# Altium project F4Test.PrjPcb
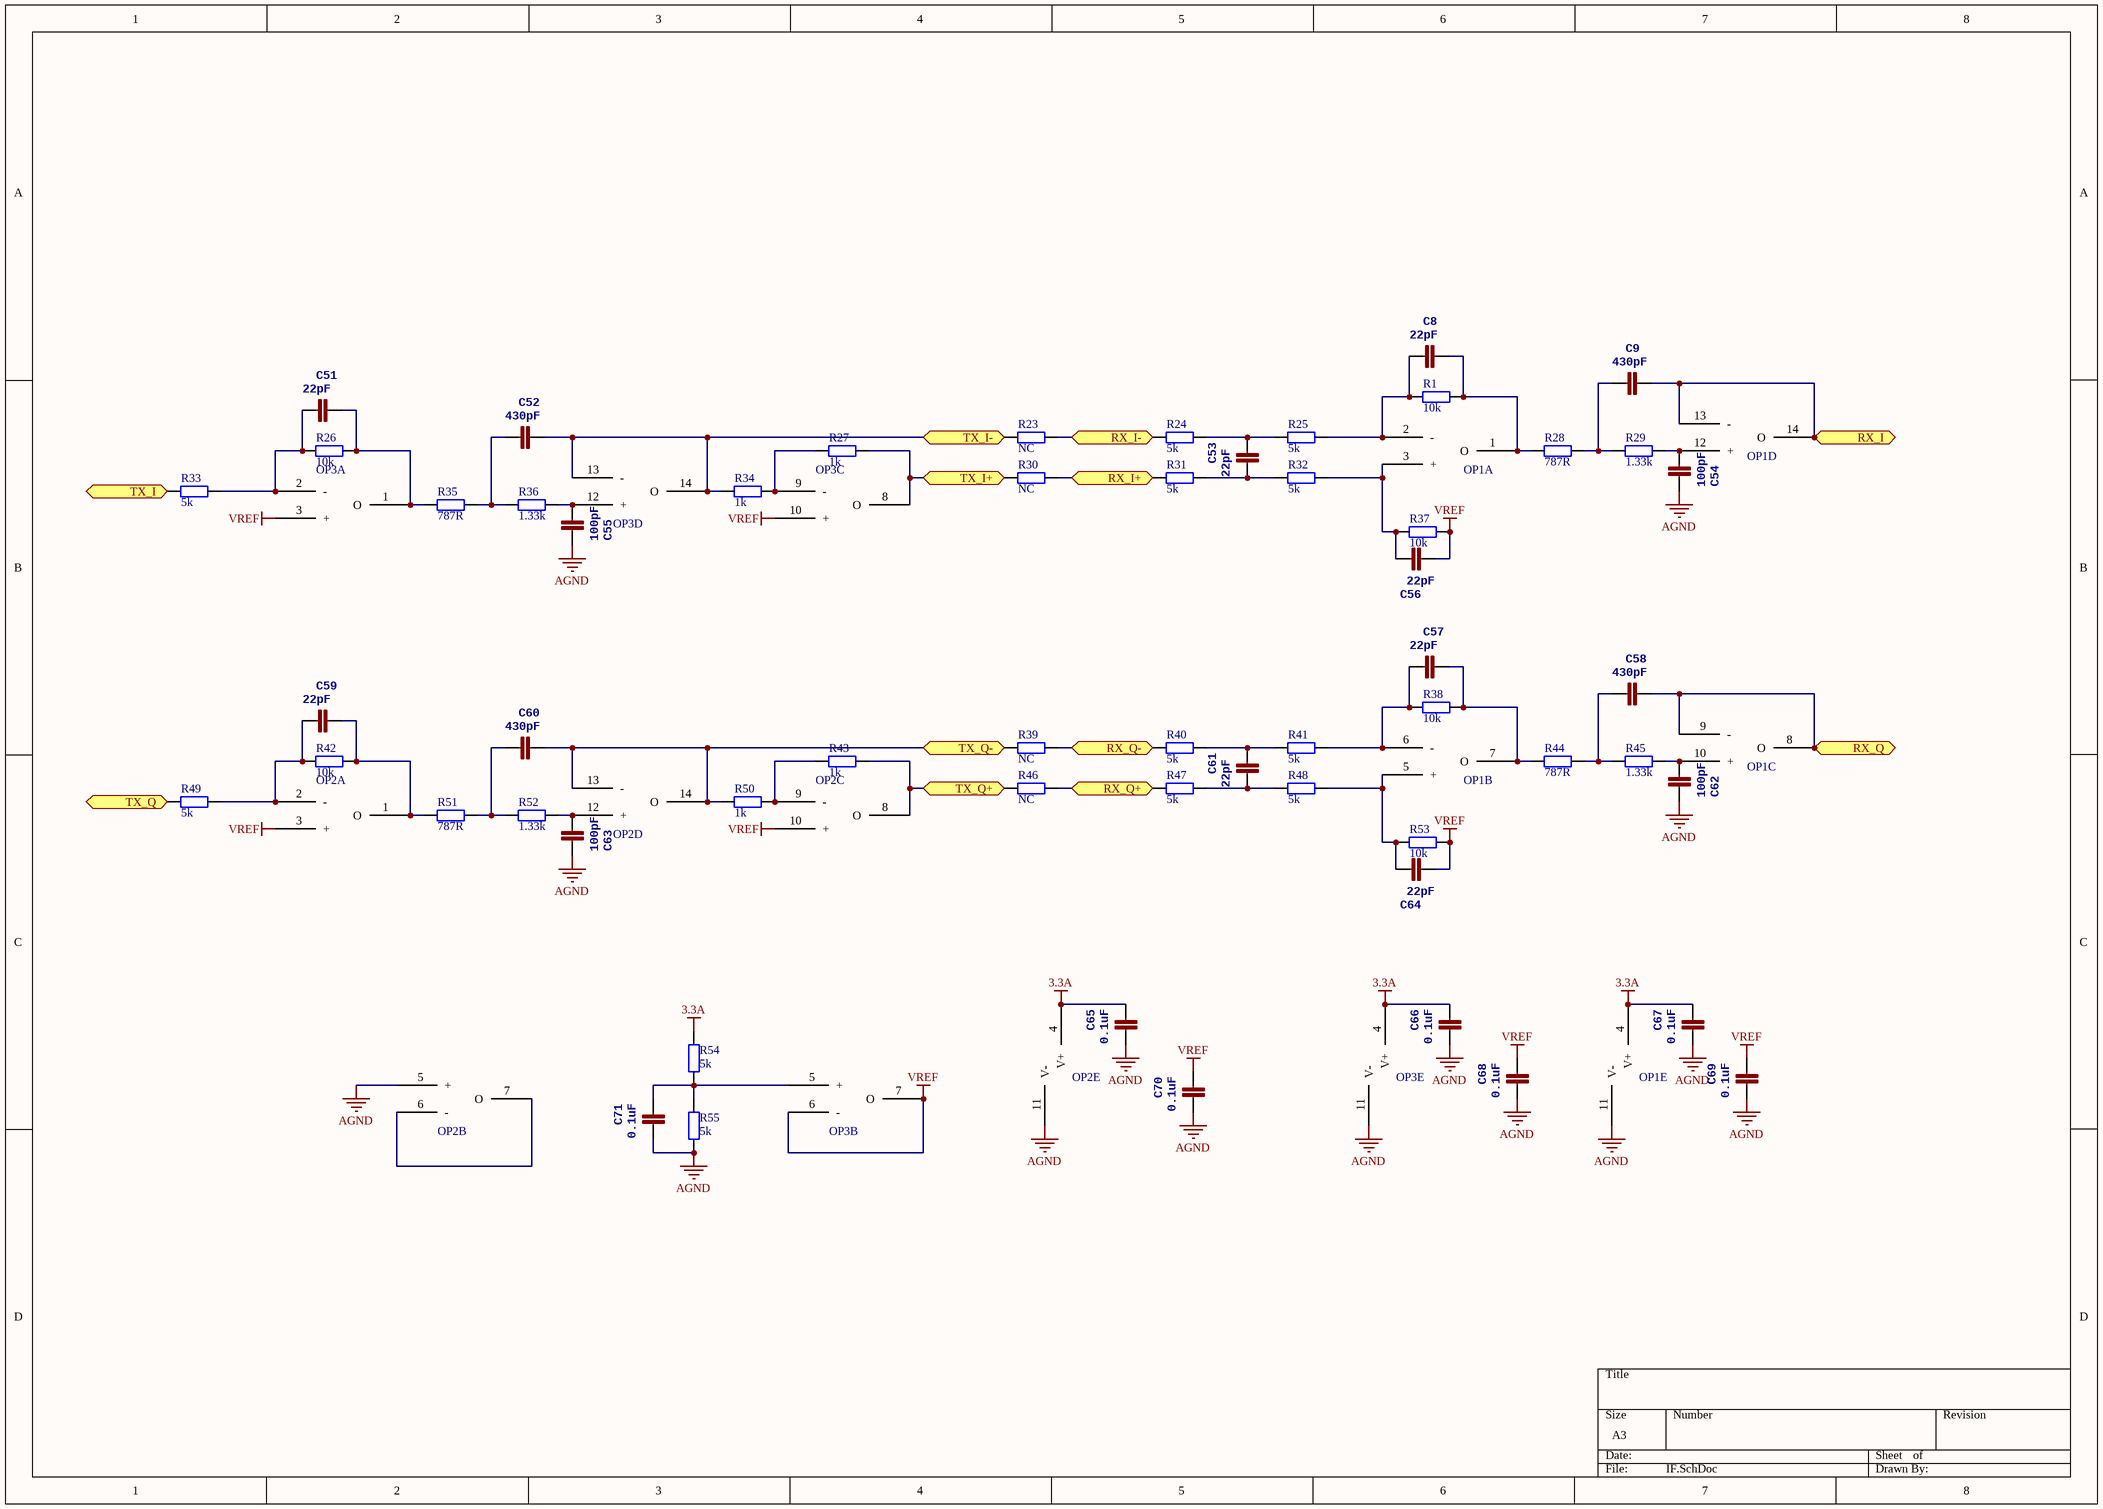
[diagram p0: IF.SchDoc]
3 sheets, 127 parts. Net scope: flat (ports and power ports of the same name join across sheets).
Board file: F4Test.PcbDoc
Sheets:
  IF.SchDoc
  USB_HS2.SchDoc
  mcu2.SchDoc

## Sheet IF.SchDoc
size A3

### Parts
C8  22pF  [0402]
C9  430pF  [0402]
C51  22pF  [0402]
C52  430pF  [0402]
C53  22pF  [0402]
C54  100pF  [0402]
C55  100pF  [0402]
C56  22pF  [0402]
C57  22pF  [0402]
C58  430pF  [0402]
C59  22pF  [0402]
C60  430pF  [0402]
C61  22pF  [0402]
C62  100pF  [0402]
C63  100pF  [0402]
C64  22pF  [0402]
C65  0.1uF  [0402]
C66  0.1uF  [0402]
C67  0.1uF  [0402]
C68  0.1uF  [0402]
C69  0.1uF  [0402]
C70  0.1uF  [0402]
C71  0.1uF  [0402]
OP1  MCP6024  (value not drawn)  (parts A,B,C,D,E of 5)
OP2  MCP6024  (value not drawn)  (parts A,B,C,D,E of 5)
OP3  MCP6024  (value not drawn)  (parts A,B,C,D,E of 5)
R1  10k  [0402]
R23  NC  [0402]
R24  5k  [0402]
R25  5k  [0402]
R26  10k  [0402]
R27  1k  [0402]
R28  787R  [0402]
R29  1.33k  [0402]
R30  NC  [0402]
R31  5k  [0402]
R32  5k  [0402]
R33  5k  [0402]
R34  1k  [0402]
R35  787R  [0402]
R36  1.33k  [0402]
R37  10k  [0402]
R38  10k  [0402]
R39  NC  [0402]
R40  5k  [0402]
R41  5k  [0402]
R42  10k  [0402]
R43  1k  [0402]
R44  787R  [0402]
R45  1.33k  [0402]
R46  NC  [0402]
R47  5k  [0402]
R48  5k  [0402]
R49  5k  [0402]
R50  1k  [0402]
R51  787R  [0402]
R52  1.33k  [0402]
R53  10k  [0402]
R54  5k  [0402]
R55  5k  [0402]

### Ports
RX_I, RX_I+, RX_I-, RX_Q, RX_Q+, RX_Q-, TX_I, TX_I+, TX_I-, TX_Q, TX_Q+, TX_Q-

### Nets
3.3A: C65.1 C66.1 C67.1 OP1.4(V+) OP2.4(V+) OP3.4(V+) R54.1
AGND: C54.1 C55.1 C62.1 C63.1 C65.2 C66.2 C67.2 C68.2 C69.2 C70.2 C71.2 OP1.11(V-) OP2.5(+) OP2.11(V-) OP3.11(V-) R55.2
VREF: C56.2 C64.2 C68.1 C69.1 C70.1 OP2.3(+) OP2.10(+) OP3.3(+) OP3.6(-) OP3.7(O) OP3.10(+) R37.1 R53.1
NetC8_1: C8.1 OP1.1(O) R1.1 R28.2
NetC8_2: C8.2 OP1.2(-) R1.2 R25.1
NetC9_1: C9.1 OP1.13(-) OP1.14(O) ; port RX_I
NetC9_2: C9.2 R28.1 R29.2
NetC51_1: C51.1 OP3.1(O) R26.1 R35.2
NetC51_2: C51.2 OP3.2(-) R26.2 R33.1
NetC52_1: C52.1 OP3.13(-) OP3.14(O) R23.2 R34.2 ; port TX_I-
NetC52_2: C52.2 R35.1 R36.2
NetC53_1: C53.1 R24.1 R25.2
NetC53_2: C53.2 R31.1 R32.2
NetC54_2: C54.2 OP1.12(+) R29.1
NetC55_2: C55.2 OP3.12(+) R36.1
NetC56_1: C56.1 OP1.3(+) R32.1 R37.2
NetC57_1: C57.1 OP1.7(O) R38.1 R44.2
NetC57_2: C57.2 OP1.6(-) R38.2 R41.1
NetC58_1: C58.1 OP1.8(O) OP1.9(-) ; port RX_Q
NetC58_2: C58.2 R44.1 R45.2
NetC59_1: C59.1 OP2.1(O) R42.1 R51.2
NetC59_2: C59.2 OP2.2(-) R42.2 R49.1
NetC60_1: C60.1 OP2.13(-) OP2.14(O) R39.2 R50.2 ; port TX_Q-
NetC60_2: C60.2 R51.1 R52.2
NetC61_1: C61.1 R40.1 R41.2
NetC61_2: C61.2 R47.1 R48.2
NetC62_2: C62.2 OP1.10(+) R45.1
NetC63_2: C63.2 OP2.12(+) R52.1
NetC64_1: C64.1 OP1.5(+) R48.1 R53.2
NetC71_1: C71.1 OP3.5(+) R54.2 R55.1
NetOP2_6: OP2.6(-) OP2.7(O)
NetOP2_8: OP2.8(O) R43.1 R46.2 ; port TX_Q+
NetOP2_9: OP2.9(-) R43.2 R50.1
NetOP3_8: OP3.8(O) R27.1 R30.2 ; port TX_I+
NetOP3_9: OP3.9(-) R27.2 R34.1
NetR3_2: R49.2 ; port TX_Q
NetR23_1: R23.1 R24.2 ; port RX_I-
NetR30_1: R30.1 R31.2 ; port RX_I+
NetR33_2: R33.2 ; port TX_I
NetR39_1: R39.1 R40.2 ; port RX_Q-
NetR46_1: R46.1 R47.2 ; port RX_Q+

### Library data of the parts
C8 C9 C51-C71 = CAP0402-CAP: <b>Capacitor</b> / Standard 0603 ceramic capacitor, and 0.1" leaded capacitor.; PARTNO: CC0402ZRY5V7BB104
OP1-OP3 = OP-SOP14
R1 R23-R55 = Res2: Resistor; Published: 8-Jun-2000; LatestRevisionDate: 17-Jul-2002; LatestRevisionNote: Re-released for DXP Platform.; PackageReference: AXIAL-0.4; Publisher: Altium Limited; PackageDescription: Axial Device, Thru-Hole; 2 Leads; 0.4 in Pin Spacing

## Sheet USB_HS2.SchDoc
size A4
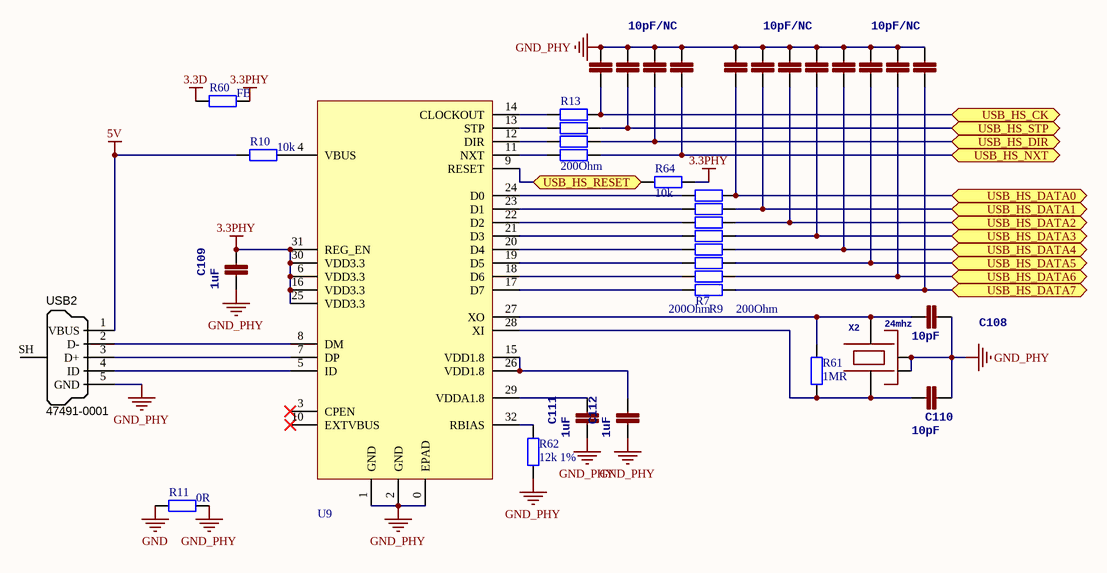
[diagram p1: USB_HS2.SchDoc]

### Parts
(Parts that share a designator on the sheet are numbered #1, #2 ... from top to bottom, then left to right.)
C17  10pF/NC  [0402]
C18  1n  [0402]  (value not drawn)
C19  1n  [0402]  (value not drawn)
C20  1n  [0402]  (value not drawn)
C21  10pF/NC  [0402]
C22  1n  [0402]  (value not drawn)
C23  1n  [0402]  (value not drawn)
C24  1n  [0402]  (value not drawn)
C25  10pF/NC  [0402]
C26  1n  [0402]  (value not drawn)
C27  1n  [0402]  (value not drawn)
C28  1n  [0402]  (value not drawn)
C108  10pF  [0402]
C109  1uF  [0402]
C110  10pF  [0402]
C111  1uF  [0402]
C112  1uF  [0402]
R7  value 200Ohm  [0402X4]  (hidden comment: Res*4)
R9  value 200Ohm  [0402X4]  (hidden comment: Res*4)
R10  10k  [0402]
R11  0R  [0603]
R13#1  value 200Ohm  [0402X4]  (hidden comment: Res*4)
R60  FB  [0603]
R61  1MR  [0402]
R62  12k 1%  [0402]
R64  10k  [0402]
U9  USB3300_1  [USB3300]  (value not drawn)
USB2  Manufacturer Part Number 1: 47491-0001  [MICRO-YZX]  (hidden comment: USB Micro Type B)
X2  24mhz  [OSCILLATOR-3.2X2.5]

### Ports
USB_HS_CK, USB_HS_DATA0, USB_HS_DATA1, USB_HS_DATA2, USB_HS_DATA3, USB_HS_DATA4, USB_HS_DATA5, USB_HS_DATA6, USB_HS_DATA7, USB_HS_DIR, USB_HS_NXT, USB_HS_RESET, USB_HS_STP

### Nets
3.3D: R60.1
3.3PHY: C109.1 R60.2 R64.1 U9.6(VDD3.3) U9.16(VDD3.3) U9.25(VDD3.3) U9.30(VDD3.3) U9.31(REG_EN)
5V: R10.1 USB2.1(VBUS)
GND: R11.1
GND_PHY: C17.2 C18.2 C19.2 C20.2 C21.2 C22.2 C23.2 C24.2 C25.2 C26.2 C27.2 C28.2 C108.1 C109.2 C110.1 C111.2 C112.2 R11.2 R62.1 U9.0(EPAD) U9.1(GND) U9.2(GND) USB2.5(GND) X2.2(NC_2) X2.4(NC_4)
NetC17_1: C17.1 R13#1.4 ; port USB_HS_CK
NetC18_1: C18.1 R13#1.3 ; port USB_HS_STP
NetC19_1: C19.1 R13#1.2 ; port USB_HS_DIR
NetC20_1: C20.1 R13#1.1 ; port USB_HS_NXT
NetC21_1: C21.1 R9.8 ; port USB_HS_DATA0
NetC22_1: C22.1 R9.7 ; port USB_HS_DATA1
NetC23_1: C23.1 R9.6 ; port USB_HS_DATA2
NetC24_1: C24.1 R9.5 ; port USB_HS_DATA3
NetC25_1: C25.1 R7.8 ; port USB_HS_DATA4
NetC26_1: C26.1 R7.7 ; port USB_HS_DATA5
NetC27_1: C27.1 R7.6 ; port USB_HS_DATA6
NetC28_1: C28.1 R7.5 ; port USB_HS_DATA7
NetC108_2: C108.2 R61.2 U9.27(XO) X2.3
NetC110_2: C110.2 R61.1 U9.28(XI) X2.1
NetC111_1: C111.1 U9.29(VDDA1.8)
NetC112_1: C112.1 U9.15(VDD1.8) U9.26(VDD1.8)
NetR7_1: R7.1 U9.20(D4)
NetR7_2: R7.2 U9.19(D5)
NetR7_3: R7.3 U9.18(D6)
NetR7_4: R7.4 U9.17(D7)
NetR9_1: R9.1 U9.24(D0)
NetR9_2: R9.2 U9.23(D1)
NetR9_3: R9.3 U9.22(D2)
NetR9_4: R9.4 U9.21(D3)
NetR10_2: R10.2 U9.4(VBUS)
NetR13#1_5: R13#1.5 U9.14(CLOCKOUT)
NetR13#1_6: R13#1.6 U9.13(STP)
NetR13#1_7: R13#1.7 U9.12(DIR)
NetR13#1_8: R13#1.8 U9.11(NXT)
NetR62_2: R62.2 U9.32(RBIAS)
NetR64_2: R64.2 U9.9(RESET) ; port USB_HS_RESET
NetU9_5: U9.5(ID) USB2.4(ID)
NetU9_7: U9.7(DP) USB2.3(D+)
NetU9_8: U9.8(DM) USB2.2(D-)

Not connected (* = marked no-connect by the designer): U9 3(CPEN)* 10(EXTVBUS)*; USB2 SH(Shell)

### Library data of the parts
C17-C28 C108-C112 = CAP0402-CAP: as C8 on sheet IF
R7 R9 R13#1 = Res*4: Resistor; Published: 8-Jun-2000; LatestRevisionDate: 17-Jul-2002; LatestRevisionNote: Re-released for DXP Platform.; PackageReference: AXIAL-0.4; Publisher: Altium Limited; PackageDescription: Axial Device, Thru-Hole; 2 Leads; 0.4 in Pin Spacing
R10 R11 R60-R62 R64 = Res2: Resistor; Value: 0Ohm; Published: 8-Jun-2000; LatestRevisionDate: 17-Jul-2002; LatestRevisionNote: Re-released for DXP Platform.; PackageReference: AXIAL-0.4; Publisher: Altium Limited; PackageDescription: Axial Device, Thru-Hole; 2 Leads; 0.4 in Pin Spacing
USB2 = USB_Micro_TypeB: Connector SMD USB Micro Type B middle mount; Manufacturer 1: Molex Inc; SCDType: undef; Package / Case: SMD; Supplier 1: Digi-Key; Supplier Part Number 1: WM17142CT-ND
X2 = OSCILLATOR-3.2X2.5: Crystal Oscillator in 3.2x2.5 SMD

## Sheet mcu2.SchDoc
size A4
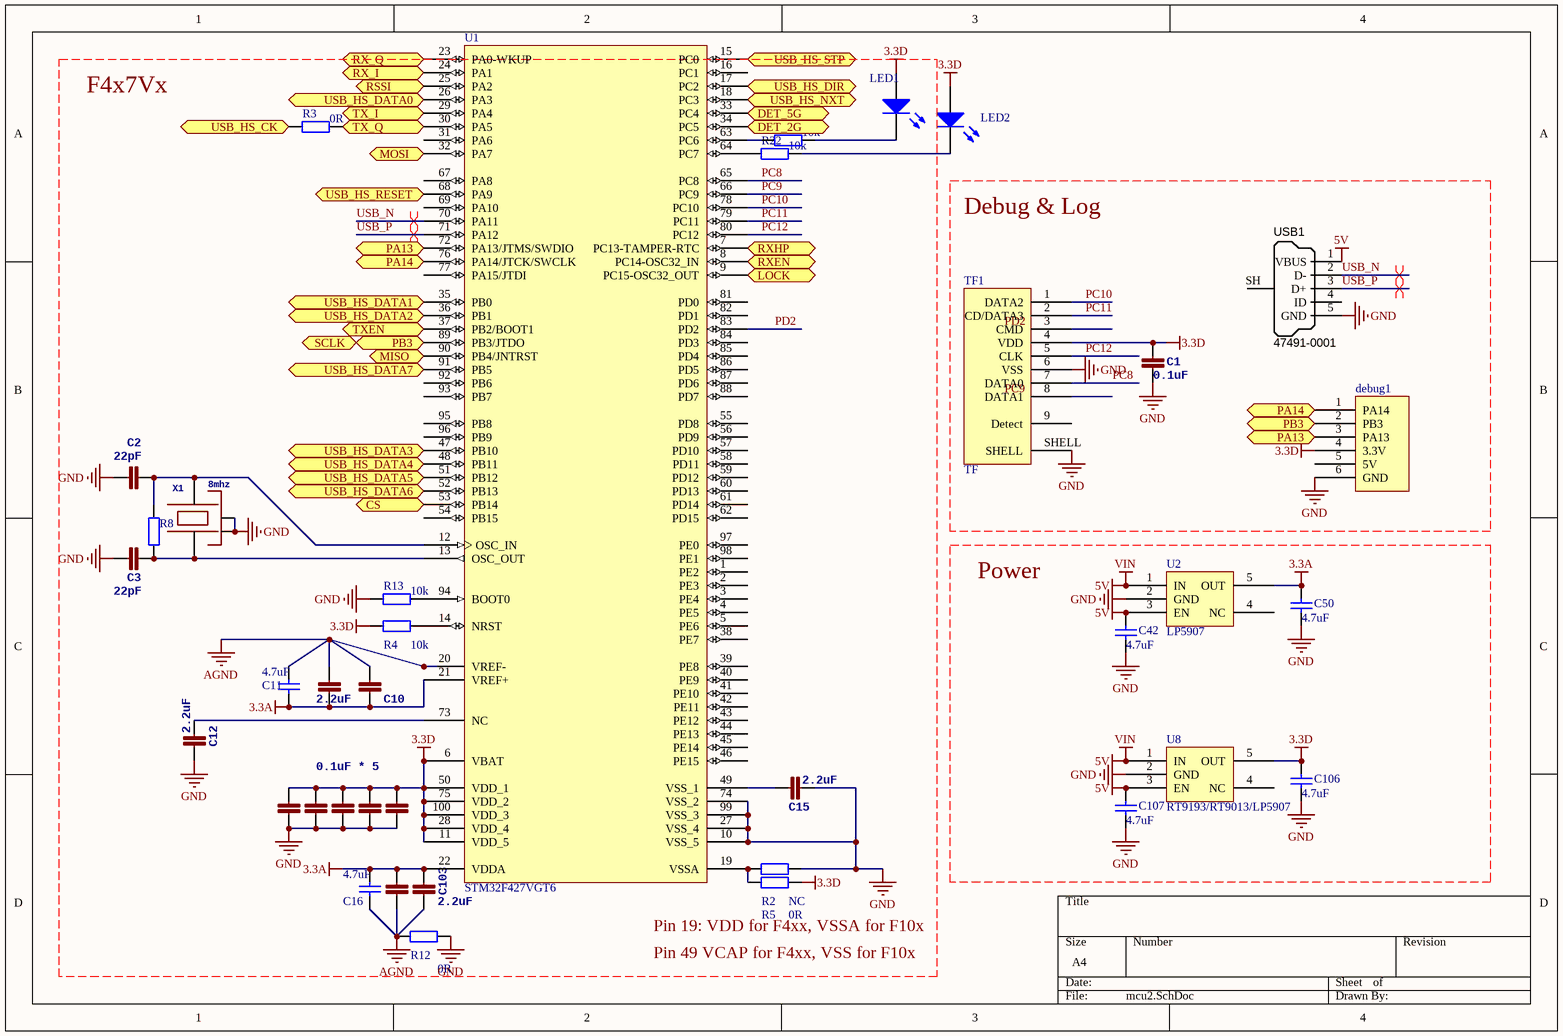
[diagram p2: mcu2.SchDoc]

### Parts
(Parts that share a designator on the sheet are numbered #1, #2 ... from top to bottom, then left to right.)
C1  0.1uF  [0402]
C2  22pF  [0402]
C3  22pF  [0402]
C4  0.1uF * 5  [0402]
C5  1n  [0402]  (value not drawn)
C6  1n  [0402]  (value not drawn)
C7  1n  [0402]  (value not drawn)
C10  2.2uF  [0603]
C11  4.7uF  [0805]
C12  2.2uF  [0603]
C13  1n  [0402]  (value not drawn)
C14  1n  [0402]  (value not drawn)
C15  2.2uF  [0603]
C16  4.7uF  [0805]
C42  4.7uF  [0603]
C50  4.7uF  [0603]
C102  1n  [0402]  (value not drawn)
C103  2.2uF  [0603]
C106  4.7uF  [0603]
C107  4.7uF  [0603]
debug1  debug  [WFRSM125]  (value not drawn)
LED1  LED0  [0603]  (value not drawn)
LED2  LED0  [0603]  (value not drawn)
R2  0R  [0402]
R3  0R  [0402]
R4  10k  [0402]
R5  NC  [0402]
R8  (no value)  [0402]
R12  0R  [0402]
R13#2  10k  [0402]
R21  10k  [0402]
R22  10k  [0402]
TF1  TF  [TF]
U1  STM32F427VGT6  [LQFP100_N]
U2  LP5907  [SOT23-5]
U8  RT9193/RT9013/LP5907  [SOT23-5]
USB1  Manufacturer Part Number 1: 47491-0001  [MICRO-YZX]  (hidden comment: USB Micro Type B)
X1  8mhz  [OSCILLATOR-3.2X2.5]

### Ports
CS, DET_2G, DET_5G, LOCK, MISO, MOSI, PA13, PA14, PB3, RSSI, RX_I, RX_Q, RXEN, RXHP, SCLK, TX_I, TX_Q, TXEN, USB_HS_CK, USB_HS_DATA0, USB_HS_DATA1, USB_HS_DATA2, USB_HS_DATA3, USB_HS_DATA4, USB_HS_DATA5, USB_HS_DATA6, USB_HS_DATA7, USB_HS_DIR, USB_HS_NXT, USB_HS_RESET, USB_HS_STP

### Nets
3.3A: C7.1 C10.1 C11.2 C16.1 C50.2 C102.2 C103.2 U1.21(VREF+) U1.22(VDDA) U2.5(OUT)
3.3D: C1.2 C4.2 C5.2 C6.2 C13.2 C14.2 C106.2 debug1.4(3.3V) LED1.1(A) LED2.1(A) R2.1 R4.2 TF1.4(VDD) U1.6(VBAT) U1.11(VDD_5) U1.28(VDD_4) U1.50(VDD_1) U1.75(VDD_2) U1.100(VDD_3) U8.5(OUT)
5V: C42.2 C107.2 U2.1(IN) U2.3(EN) U8.1(IN) U8.3(EN) USB1.1(VBUS)  [also labelled VIN]
AGND: C7.2 C10.2 C11.1 C16.2 C102.1 C103.1 R12.2 U1.20(VREF-)
GND: C1.1 C2.2 C3.2 C4.1 C5.1 C6.1 C12.1 C13.1 C14.1 C15.2 C42.1 C50.1 C106.1 C107.1 debug1.6(GND) R5.1 R12.1 R13#2.1 TF1.6(VSS) TF1.SHELL U1.10(VSS_5) U1.27(VSS_4) U1.74(VSS_2) U1.99(VSS_3) U2.2(GND) U8.2(GND) USB1.5(GND) X1.2(NC_2) X1.4(NC_4)
PC8: TF1.7(DATA0) U1.65(PC8)
PC9: U1.66(PC9)
PC10: TF1.1(DATA2) U1.78(PC10)
PC11: TF1.2(CD/DATA3) U1.79(PC11)
PC12: TF1.5(CLK) U1.80(PC12)
PD2: U1.83(PD2)
USB_N: U1.70(PA11) USB1.2(D-)
USB_P: U1.71(PA12) USB1.3(D+)
NetC2_1: C2.1 R8.2 U1.12(OSC_IN) X1.3
NetC3_1: C3.1 R8.1 U1.13(OSC_OUT) X1.1
NetC9_1: U1.24(PA1) ; port RX_I
NetC12_2: C12.2 U1.73(NC)
NetC15_1: C15.1 U1.49(VSS_1)
NetC17_1: R3.1 ; port USB_HS_CK
NetC18_1: U1.15(PC0) ; port USB_HS_STP
NetC19_1: U1.17(PC2) ; port USB_HS_DIR
NetC20_1: U1.18(PC3) ; port USB_HS_NXT
NetC21_1: U1.26(PA3) ; port USB_HS_DATA0
NetC22_1: U1.35(PB0) ; port USB_HS_DATA1
NetC23_1: U1.36(PB1) ; port USB_HS_DATA2
NetC24_1: U1.47(PB10) ; port USB_HS_DATA3
NetC25_1: U1.48(PB11) ; port USB_HS_DATA4
NetC26_1: U1.51(PB12) ; port USB_HS_DATA5
NetC27_1: U1.52(PB13) ; port USB_HS_DATA6
NetC28_1: U1.91(PB5) ; port USB_HS_DATA7
NetC58_1: U1.23(PA0-WKUP) ; port RX_Q
Netdebug1_1: debug1.1(PA14) U1.76(PA14/JTCK/SWCLK) ; port PA14
Netdebug1_2: debug1.2(PB3) U1.89(PB3/JTDO) ; port SCLK, port PB3
Netdebug1_3: debug1.3(PA13) U1.72(PA13/JTMS/SWDIO) ; port PA13
NetLED1_2: LED1.2(K) R21.2
NetLED2_2: LED2.2(K) R22.2
NetR2_2: R2.2 R5.2 U1.19(VSSA)
NetR3_2: R3.2 U1.30(PA5) ; port TX_Q
NetR4_1: R4.1 U1.14(NRST)
NetR13#2_2: R13#2.2 U1.94(BOOT0)
NetR21_1: R21.1 U1.63(PC6)
NetR22_1: R22.1 U1.64(PC7)
NetR33_2: U1.29(PA4) ; port TX_I
NetR64_2: U1.68(PA9) ; port USB_HS_RESET
NetU1_7: U1.7(PC13-TAMPER-RTC) ; port RXHP
NetU1_8: U1.8(PC14-OSC32_IN) ; port RXEN
NetU1_9: U1.9(PC15-OSC32_OUT) ; port LOCK
NetU1_25: U1.25(PA2) ; port RSSI
NetU1_32: U1.32(PA7) ; port MOSI
NetU1_33: U1.33(PC4) ; port DET_5G
NetU1_34: U1.34(PC5) ; port DET_2G
NetU1_37: U1.37(PB2/BOOT1) ; port TXEN
NetU1_53: U1.53(PB14) ; port CS
NetU1_90: U1.90(PB4/JNTRST) ; port MISO

Not connected (* = marked no-connect by the designer): debug1 5(5V); TF1 3(CMD) 8(DATA1) 9(Detect); U1 1(PE2) 2(PE3) 3(PE4) 4(PE5) 5(PE6) 16(PC1) 31(PA6) 38(PE7) 39(PE8) 40(PE9) 41(PE10) 42(PE11) 43(PE12) 44(PE13) 45(PE14) 46(PE15) 54(PB15) 55(PD8) 56(PD9) 57(PD10) 58(PD11) 59(PD12) 60(PD13) 61(PD14) 62(PD15) 67(PA8) 69(PA10) 77(PA15/JTDI) 81(PD0) 82(PD1) 84(PD3) 85(PD4) 86(PD5) 87(PD6) 88(PD7) 92(PB6) 93(PB7) 95(PB8) 96(PB9) 97(PE0) 98(PE1); U2 4(NC); U8 4(NC); USB1 4(ID) SH(Shell)

### Layout directives
differential pair: USB_N, USB_P

### Notes on the sheet
- F4x7Vx
- Debug & Log
- Power
- Pin 19: VDD for F4xx, VSSA for F10x
- Pin 49 VCAP for F4xx, VSS for F10x
- Labels drawn without touching a wire or pin: PC9, PD2

### Library data of the parts
C1-C7 C10 C12-C15 C102 C103 = CAP0402-CAP: as C8 on sheet IF
C11 C16 C42 C50 C106 C107 = Cap: Capacitor; Published: 8-Jun-2000; LatestRevisionDate: 17-Jul-2002; LatestRevisionNote: Re-released for DXP Platform.; PackageReference: RAD-0.3; Publisher: Altium Limited; PackageDescription: Radial Cap, Thru-Hole; 2 Leads; 0.3 in Pin Spacing
LED1 LED2 = LED0: Typical INFRARED GaAs LED; Published: 8-Jun-2000; LatestRevisionDate: 08-Jul-2005; LatestRevisionNote: Mech Layer 1 removed.; PackageReference: LED-0; Publisher: Altium Limited; PackageDescription: LED; 2 Leads
R2-R5 R8 R12 R13#2 R21 R22 = Res2: Resistor; Value: 0Ohm; Published: 8-Jun-2000; LatestRevisionDate: 17-Jul-2002; LatestRevisionNote: Re-released for DXP Platform.; PackageReference: AXIAL-0.4; Publisher: Altium Limited; PackageDescription: Axial Device, Thru-Hole; 2 Leads; 0.4 in Pin Spacing
U1 = STM32F103VBT6: STM32 ARM-based 32-bit MCU with 64 Kbytes Flash, 100-pin LQFP, Industrial Temperature; Published: *; DatasheetVersion: *; PackageVersion: *; PackageReference: *; Publisher: *; PackageDescription: *; ComponentLink1Description: *; ComponentLink1URL: *; ComponentLink2Description: *; ComponentLink2URL: *
U8 = LP5907
USB1 = USB_Micro_TypeB: as USB2 on sheet USB_HS2; Package / Case: SMD; Supplier 1: Digi-Key; Supplier Part Number 1: WM17142CT-ND
X1 = OSCILLATOR-3.2X2.5: Crystal Oscillator in 3.2x2.5 SMD

## Nets that join several sheets
3.3A: IF (7 pins), mcu2 (10 pins)
3.3D: USB_HS2 (R60.1), mcu2 (20 pins)
5V: USB_HS2 (R10.1 USB2.1), mcu2 (7 pins)
AGND: IF (16 pins), mcu2 (8 pins)
GND: USB_HS2 (R11.1), mcu2 (29 pins)
NetC9_1: IF (C9.1 OP1.13 OP1.14), mcu2 (U1.24)
NetC17_1: USB_HS2 (C17.1 R13#1.4), mcu2 (R3.1)
NetC18_1: USB_HS2 (C18.1 R13#1.3), mcu2 (U1.15)
NetC19_1: USB_HS2 (C19.1 R13#1.2), mcu2 (U1.17)
NetC20_1: USB_HS2 (C20.1 R13#1.1), mcu2 (U1.18)
NetC21_1: USB_HS2 (C21.1 R9.8), mcu2 (U1.26)
NetC22_1: USB_HS2 (C22.1 R9.7), mcu2 (U1.35)
NetC23_1: USB_HS2 (C23.1 R9.6), mcu2 (U1.36)
NetC24_1: USB_HS2 (C24.1 R9.5), mcu2 (U1.47)
NetC25_1: USB_HS2 (C25.1 R7.8), mcu2 (U1.48)
NetC26_1: USB_HS2 (C26.1 R7.7), mcu2 (U1.51)
NetC27_1: USB_HS2 (C27.1 R7.6), mcu2 (U1.52)
NetC28_1: USB_HS2 (C28.1 R7.5), mcu2 (U1.91)
NetC58_1: IF (C58.1 OP1.8 OP1.9), mcu2 (U1.23)
NetR3_2: IF (R49.2), mcu2 (R3.2 U1.30)
NetR33_2: IF (R33.2), mcu2 (U1.29)
NetR64_2: USB_HS2 (R64.2 U9.9), mcu2 (U1.68)